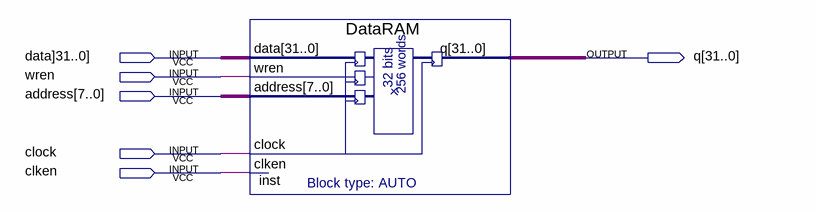
[diagram p0: schematic sheet]
// Quartus schematic DataRAM.bdf as structural Verilog: 1 symbols, 6 pins
module DataRAM (
  input  \data]31..0] ,
  input  wren,
  input  [7:0] address,
  input  clock,
  input  clken,
  output [31:0] q
);

  wire [31:0] undriven;

  DataRAM inst (.data(undriven), .wren(wren), .address(address), .clock(clock), .clken(clken), .q(q));
endmodule
